# Altium project ECG_circuit.PrjPcb
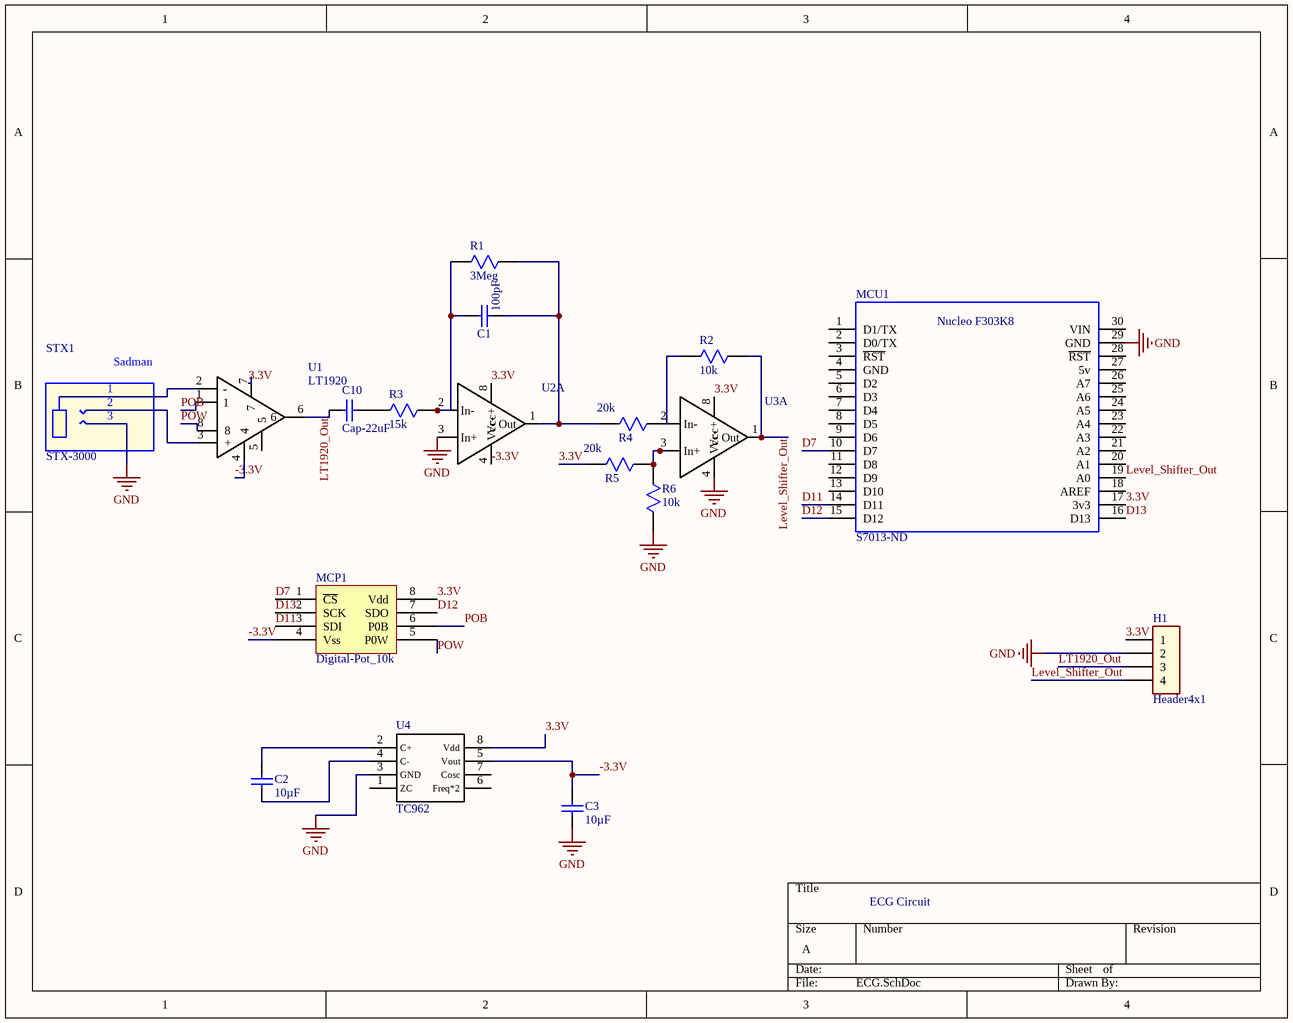
[diagram p0: ECG.SchDoc]
1 sheet, 18 parts. Net scope: global (net labels, ports and power ports of the same name join across sheets).
Board file: PCB1.PcbDoc

## Sheet ECG.SchDoc
size A; SheetNumber: 1; SheetTotal: 1

### Parts
C1  Cap-100pF  [Capacitor]  (value not drawn)
C2  Capacitance: 10µF  [Capacitor]  (hidden comment: Cap-10u)
C3  Capacitance: 10µF  [Capacitor]  (hidden comment: Cap-10u)
C10  Cap-22uF  [Capacitor - Polarized]
H1  Header4x1  [4 pin header]
MCP1  Digital-Pot_10k  [DIP8]
MCU1  Supplier Part Number 1: S7013-ND  [Nucleo F303K8]  (hidden comment: Nucleo F303K8_FINISHED)
R1  Resistance (Ohms): 3Meg  [RESISTOR]  (hidden comment: Res-3M)
R2  Resistance (Ohms): 10k  [RESISTOR]  (hidden comment: Res-10k)
R3  15k  [RESISTOR]
R4  20k  [RESISTOR]
R5  20k  [RESISTOR]
R6  Resistance (Ohms): 10k  [RESISTOR]  (hidden comment: Res-10k)
STX1  STX-3000  [STX-3000]
U1  LT1920  [DIP8]
U2  TL072  [DIP8]  (value not drawn)  (part A of 2)
U3  TL072  [DIP8]  (value not drawn)  (part A of 2)
U4  TC962  [DIP8]

### Nets
GND: C3.1 H1.2 MCU1.29(GND) R6.2 STX1.3 U2.3(In+) U3.4(Vcc-) U4.3(GND)
3.3V: H1.1 MCP1.8(Vdd) MCU1.17(3v3) R5.1 U1.7 U2.8(Vcc+) U3.8(Vcc+) U4.8(Vdd)
-3.3V: C3.2 MCP1.4(Vss) U1.4 U2.4(Vcc-) U4.5(Vout)
D7: MCP1.1(~{CS}) MCU1.10(D7)
D11: MCP1.3(SDI) MCU1.14(D11)
D12: MCP1.7(SDO) MCU1.15(D12)
D13: MCP1.2(SCK) MCU1.16(D13)
Level_Shifter_Out: H1.4 MCU1.19(A0) R2.2 U3.1(Out)
LT1920_Out: C10.2 H1.3 U1.6
POB: MCP1.6(P0B) U1.1
POW: MCP1.5(P0W) U1.8
NetC1_1: C1.1 R1.2 R4.1 U2.1(Out)
NetC1_2: C1.2 R1.1 R3.2 U2.2(In-)
NetC2_1: C2.1 U4.4(C-)
NetC2_2: C2.2 U4.2(C+)
NetC10_1: C10.1 R3.1
NetR2_1: R2.1 R4.2
NetR5_2: R5.2 R6.1 U3.3(In+)
NetSTX1_1: STX1.1 U1.2(-)
NetSTX1_2: STX1.2 U1.3(+)

Not connected (* = marked no-connect by the designer): MCU1 1(D1/TX) 2(D0/TX) 3(~{RST}) 4(GND) 5(D2) 6(D3) 7(D4) 8(D5) 9(D6) 11(D8) 12(D9) 13(D10) 18(AREF) 20(A1) 21(A2) 22(A3) 23(A4) 24(A5) 25(A6) 26(A7) 27(5v) 28(~{RST}) 30(VIN); U1 5; U3 2(In-); U4 1(ZC) 6(Freq*2) 7(Cosc)

### Notes on the sheet
- ECG Circuit
- (in symbol Cap-100pF) 100pF
- (in symbol STX-3000) Sadman

### Library data of the parts
C2 C3 = Cap-10u: Manufacturer: TDK Corporation; Manufacturer Part Number: FK26X7R1C106K; Tolerance: ±10%; Voltage - Rated: 16V; Temperature Coefficient: X7R; Supplier 1: Digi-Key; RoHS: RoHS Compliant; Category: Capacitors; Stock 1: 7933; Pricing 1: 1=0.45, 10=0.319, 100=0.2101, 250=0.17896, 500=0.1556, 1000=0.13226, 5000=0.1167, 10000=0.10892, 25000=0.10503 (USD); Packaging: Bulk; Mounting Type: Through Hole; Operating Temperature: -55°C ~ 125°C; Applications: General Purpose; Ratings: -; Package / Case: Radial; Size / Dimension: 0.217" L x 0.138" W (5.50mm x 3.50mm); Height - Seated (Max): 0.236" (6.00mm); Thickness (Max): -; Lead Spacing: 0.197" (5.00mm); Features: -; Lead Style: Formed Leads - Kinked; ComponentLink1URL: https://product.tdk.com/info/en/documents/catalog/leadmlcc_conventional_fk_en.pdf; ComponentLink1Description: https://product.tdk.com/info/en/documents/catalog/leadmlcc_conventional_fk_en.pdf; Supplier Part Number 1: 445-8549-ND
MCU1 = Nucleo F303K8_FINISHED: Nucleo F303K8; Manufacturer: Sullins Connector Solutions; Manufacturer Part Number: PPTC151LFBN-RC; Connector Type: Header; Style: Board to Board; Number of Positions: 15; Number of Positions Loaded: All; Pitch - Mating: 0.100" (2.54mm); Contact Length - Post: 0.126" (3.20mm); Material Flammability Rating: UL94 V-0; Current Rating: 3A; Voltage Rating: 250V; RoHS: RoHS Compliant; Category: Connectors, Interconnects; Packaging: Bulk; Part Status: Active; Contact Type: Female Socket; Number of Rows: 1; Row Spacing - Mating: -; Mounting Type: Through Hole; Termination: Solder; Fastening Type: Push-Pull; Contact Finish - Mating: Tin; Contact Finish Thickness - Mating: -; Insulation Color: Black; Insulation Height: 0.335" (8.51mm); Operating Temperature: -40°C ~ 105°C; Contact Finish - Post: Tin; Mated Stacking Heights: -; Ingress Protection: -; Features: -; Applications: -; Insulation Material: Polyester; Contact Shape: Square; Contact Material: Phosphor Bronze; Contact Finish Thickness - Post: -; ComponentLink1URL: http://www.sullinscorp.com/drawings/78_P(N)PxCxxxLFBN-RC,_10492-H.pdf; ComponentLink1Description: http://www.sullinscorp.com/drawings/78_P(N)PxCxxxLFBN-RC,_10492-H.pdf; Supplier 1: Digi-Key; Stock 1: 2938; Pricing 1: 1=1.22, 10=1.013, 25=0.9376, 50=0.8438, 100=0.75, 250=0.65624, 500=0.6, 1000=0.54375, 2500=0.4875 (USD)
R1 = Res-3M: Manufacturer: Stackpole Electronics Inc.; Manufacturer Part Number: CF14JT30K0; Tolerance: ±5%; Power (Watts): 0.25W, 1/4W; Temperature Coefficient: 0/ -500ppm/°C; RoHS: RoHS Compliant; Category: Resistors; Packaging: Cut Tape (CT); Part Status: Active; Composition: Carbon Film; Features: Flame Retardant Coating, Safety; Operating Temperature: -55°C ~ 155°C; Package / Case: Axial; Supplier Device Package: Axial; Size / Dimension: 0.091" Dia x 0.236" L (2.30mm x 6.00mm); Height - Seated (Max): -; Failure Rate: -; ComponentLink1URL: https://www.seielect.com/Catalog/SEI-CF_CFM.pdf; ComponentLink1Description: https://www.seielect.com/Catalog/SEI-CF_CFM.pdf; Supplier 1: Arrow
R2 R6 = Res-10k: Manufacturer: Stackpole Electronics Inc.; Manufacturer Part Number: CF14JT10K0; Tolerance: ±5%; Power (Watts): 0.25W, 1/4W; Temperature Coefficient: 0/ -500ppm/°C; Supplier 1: Digi-Key; RoHS: RoHS Compliant; Category: Resistors; Stock 1: 1509635; Pricing 1: 1=0.1, 10=0.04, 50=0.022, 100=0.0162, 250=0.01236, 500=0.0099, 1000=0.00729, 2500=0.00632 (USD); Packaging: Cut Tape (CT); Composition: Carbon Film; Features: Flame Retardant Coating, Safety; Operating Temperature: -55°C ~ 155°C; Package / Case: Axial; Supplier Device Package: Axial; Size / Dimension: 0.091" Dia x 0.256" L (2.30mm x 6.50mm); Height: -; Number of Terminations: 2; ComponentLink1URL: http://www.seielect.com/catalog/SEI-CF_CFM.pdf; ComponentLink1Description: http://www.seielect.com/catalog/SEI-CF_CFM.pdf; Supplier Part Number 1: CF14JT10K0CT-ND
R3 = Res-15k: Supplier 1: Arrow
R4 R5 = Res-20k: Supplier 1: Arrow
STX1 = STX-3000: 3 Pole(s), Female, Surface Mount Terminal, Locking, Jack; Manufacturer: Kycon; Connector Type: AUDIO/RCA CONNECTOR; Option: General Purpose; Additional Feature: ROHS COMPLIANT; Board Mounting Option: SOLDERABLE RETENTION CLIPS; Contact Resistance: 60mR; Contact Style: RND PIN-SKT; Dielectric Withstanding Voltage (AC): 350V; Durability: 5000Cycles; Insertion Force-Max: 3.9198N; Insulation Resistance: 100MR; Number Of Connectors: 1; Number of Poles: 3; Polarization Key: POLARIZED HOUSING; Withdrawl Force-Min: 2.9468N; Body Breadth: 0.213inch; Body Depth: 0.551inch; Body Length: 0.283inch; Reference Standard: UL; DIN Conformance: No; Reliability: COMMERCIAL; Supplier: Digikey; Supplier Part Number: 2092-STX-3000-ND; Manufacturer Part Number: STX-3000; RoHS: Yes; Category: Connectors; Stock: 64025; Pricing: 1=0.95, 10=0.727, 25=0.6536, 50=0.6036, 100=0.5579, 250=0.50376, 500=0.46714, 1000=0.4339, 3000=0.38746 (USD); Mounting Technology: Board; Contact Finish - Mating: NOT SPECIFIED; Contact Finish - Termination: MATTE TIN; Min Operating Temperature: -25°C; Max Operating Temperature: 80°C; JESD-609 Code: e3; Body/Shell Style: JACK; Contact Gender: Female; Mounting Style: RIGHT ANGLE; Number of Ports: 1; Termination: SMD/SMT; Mounting Option 1: LOCKING; Terminal Length: 0.11inch; Reach SVHC Compliant: Yes; RoHS Compliant: Yes; IEC Conformance: No; MIL Conformance: No; ComponentLink1URL: https://datasheet.ciiva.com:443/pdfs/VipMasterIC/IC/KYCO/KYCO-S-A0001347542/KYCO-S-A0002374289-1.pdf?src-supplier=IHS+Markit; ComponentLink1Description: https://datasheet.ciiva.com:443/pdfs/VipMasterIC/IC/KYCO/KYCO-S-A0001347542/KYCO-S-A0002374289-1.pdf?src-supplier=IHS+Markit; ComponentLink2URL: https://datasheet.ciiva.com/5053/stx-3000-182293-5053902.pdf?src-supplier=Mouser; ComponentLink2Description: https://datasheet.ciiva.com/5053/stx-3000-182293-5053902.pdf?src-supplier=Mouser
U2 U3 = TL072: Manufacturer: Texas Instruments; Manufacturer Part Number: TL072IP; Amplifier Type: J-FET; Number of Circuits: 2; Slew Rate: 13 V/µs; Current - Supply: 1.4mA; Voltage - Supply, Single/Dual (±): 7 V ~ 36 V, ±3.5 V ~ 18 V; Supplier 1: Digi-Key; RoHS: RoHS Compliant; Category: Integrated Circuits (ICs); Stock 1: 2537; Pricing 1: 1=0.69, 10=0.607, 100=0.4655, 500=0.368, 1000=0.2944 (USD); Packaging: Tube; Part Status: Active; Output Type: -; -3db Bandwidth: -; Current - Output / Channel: -; Operating Temperature: -40°C ~ 85°C; Mounting Type: Through Hole; Package / Case: 8-DIP (0.300", 7.62mm); Supplier Device Package: 8-PDIP; ComponentLink1URL: http://www.ti.com/lit/ds/symlink/tl071a.pdf; ComponentLink1Description: http://www.ti.com/lit/ds/symlink/tl071a.pdf; Supplier Part Number 1: 296-14997-5-ND
C1 = Cap-100pF: Supplier 1: Digi-Key
U1 = LT1920: Supplier 1: Digi-Key; Supplier Part Number 1: LT1920CN8#PBF-ND
U4 = TC962: Supplier 1: Digi-Key; Supplier Part Number 1: TC962CPA-ND